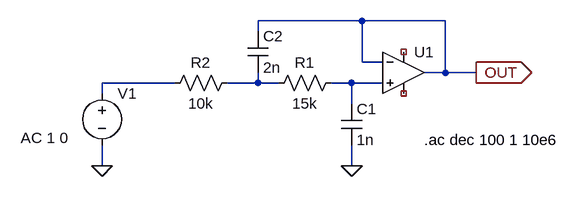
[diagram p0: schematic sallen-key.asc]
sallen-key.asc, the LTspice schematic file:
Version 4
SHEET 1 880 680
WIRE 384 0 224 0
WIRE 512 0 384 0
WIRE 224 16 224 0
WIRE 384 64 384 0
WIRE 416 64 384 64
WIRE 512 80 512 0
WIRE 512 80 480 80
WIRE 560 80 512 80
WIRE 96 96 -16 96
WIRE 224 96 224 80
WIRE 224 96 176 96
WIRE 256 96 224 96
WIRE 368 96 336 96
WIRE 416 96 368 96
WIRE -16 112 -16 96
WIRE 368 128 368 96
WIRE -16 224 -16 192
WIRE 368 224 368 192
FLAG -16 224 0
FLAG 368 224 0
FLAG 560 80 OUT
IOPIN 560 80 Out
SYMBOL voltage -16 96 R0
WINDOW 123 -125 85 Left 2
WINDOW 39 0 0 Left 0
SYMATTR InstName V1
SYMATTR Value ""
SYMATTR Value2 AC 1 0
SYMBOL OpAmps\\UniversalOpAmp 448 80 R0
SYMATTR InstName U1
SYMBOL res 352 80 R90
WINDOW 0 0 56 VBottom 2
WINDOW 3 32 56 VTop 2
SYMATTR InstName R1
SYMATTR Value 15k
SYMBOL cap 352 128 R0
SYMATTR InstName C1
SYMATTR Value 1n
SYMBOL cap 208 16 R0
SYMATTR InstName C2
SYMATTR Value 2n
SYMBOL res 192 80 R90
WINDOW 0 0 56 VBottom 2
WINDOW 3 32 56 VTop 2
SYMATTR InstName R2
SYMATTR Value 10k
TEXT 480 184 Left 2 !.ac dec 100 1 10e6

The netlist it stands for:
* sallen-key.asc
V1 N001 0 AC 1 0
XU1 N003 OUT NC_01 NC_02 OUT level1 Avol=1Meg GBW=10Meg Vos=0 En=0 Enk=0 In=0 Ink=0 Rin=500Meg  ; pins In+ In- V+ V- OUT
R1 N003 N002 15k
C1 N003 0 1n
C2 OUT N002 2n
R2 N002 N001 10k
.ac dec 100 1 10e6
.lib UniversalOpAmp1.lib
.backanno
.end